# Altium schematic sheet IRsch.SchDoc
size A
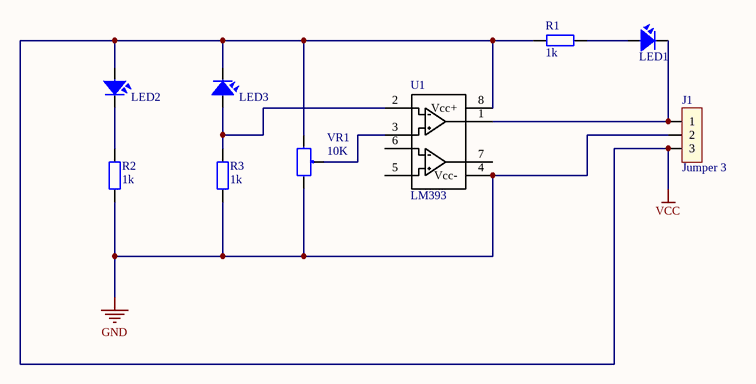
[diagram p0: IRsch.SchDoc]

## Parts
J1  Jumper 3  [JP3H]
LED1  LED  [LED-3]  (value not drawn)
LED2  LED  [LED-5-WHITE]  (value not drawn)
LED3  LED  [LED-5-WHITE]  (value not drawn)
R1  1k  [R1/2W]
R2  1k  [R1/2W]
R3  1k  [R1/2W]
U1  LM393  [DIP8]
VR1  10K  [VR]

## Nets
GND: J1.2 R2.1 R3.1 U1.4(Vcc-) VR1.3
VCC: J1.3 LED2.1 LED3.2 R1.1 U1.8(Vcc+) VR1.1
NetJ1_1: J1.1 LED1.2 U1.1
NetLED1_1: LED1.1 R1.2
NetLED2_2: LED2.2 R2.2
NetLED3_1: LED3.1 R3.2 U1.2
NetU1_3: U1.3 VR1.2

Not connected (* = marked no-connect by the designer): U1 5 6 7

## Library data of the parts
J1 = JP3: Value: J3
LED1-LED3 = LED: LED Single colour Green and Red; Value: LED 3 ly Single Colour
R1-R3 = R1/4W: Resistor 1/4W; Value: R1/4W - 1K
U1 = LM393: IC DUAL COMPARATOR
VR1 = VR: Var Resistor; Value: VR 10K